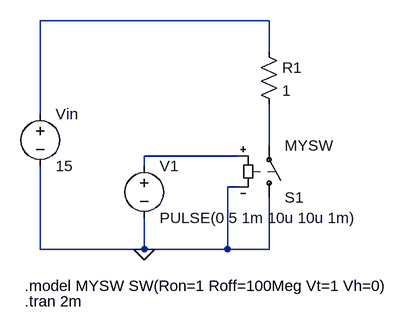
[diagram p0: schematic interruptores.asc]
interruptores.asc, the LTspice schematic file:
Version 4
SHEET 1 880 680
WIRE -320 192 -672 192
WIRE -320 240 -320 192
WIRE -672 336 -672 192
WIRE -320 384 -320 320
WIRE -368 400 -512 400
WIRE -512 416 -512 400
WIRE -368 448 -384 448
WIRE -672 544 -672 416
WIRE -512 544 -512 496
WIRE -512 544 -672 544
WIRE -384 544 -384 448
WIRE -384 544 -512 544
WIRE -320 544 -320 464
WIRE -320 544 -384 544
FLAG -512 544 0
SYMBOL sw -320 480 M180
SYMATTR InstName S1
SYMATTR Value MYSW
SYMBOL voltage -672 320 R0
WINDOW 123 0 0 Left 0
WINDOW 39 0 0 Left 0
SYMATTR InstName Vin
SYMATTR Value 15
SYMBOL voltage -512 400 R0
WINDOW 123 0 0 Left 0
WINDOW 39 0 0 Left 0
SYMATTR InstName V1
SYMATTR Value PULSE(0 5 1m 10u 10u 1m)
SYMBOL res -336 224 R0
SYMATTR InstName R1
SYMATTR Value 1
TEXT -696 600 Left 2 !.model MYSW SW(Ron=1 Roff=100Meg Vt=1 Vh=0)
TEXT -696 624 Left 2 !.tran 2m

The netlist it stands for:
* interruptores.asc
S1 0 N002 N003 0 MYSW
Vin N001 0 15
V1 N003 0 PULSE(0 5 1m 10u 10u 1m)
R1 N001 N002 1
.model MYSW SW(Ron=1 Roff=100Meg Vt=1 Vh=0)
.tran 2m
.backanno
.end